# EAGLE design ultimate_Co-Op_v2_0 (EAGLE 7.4.0)
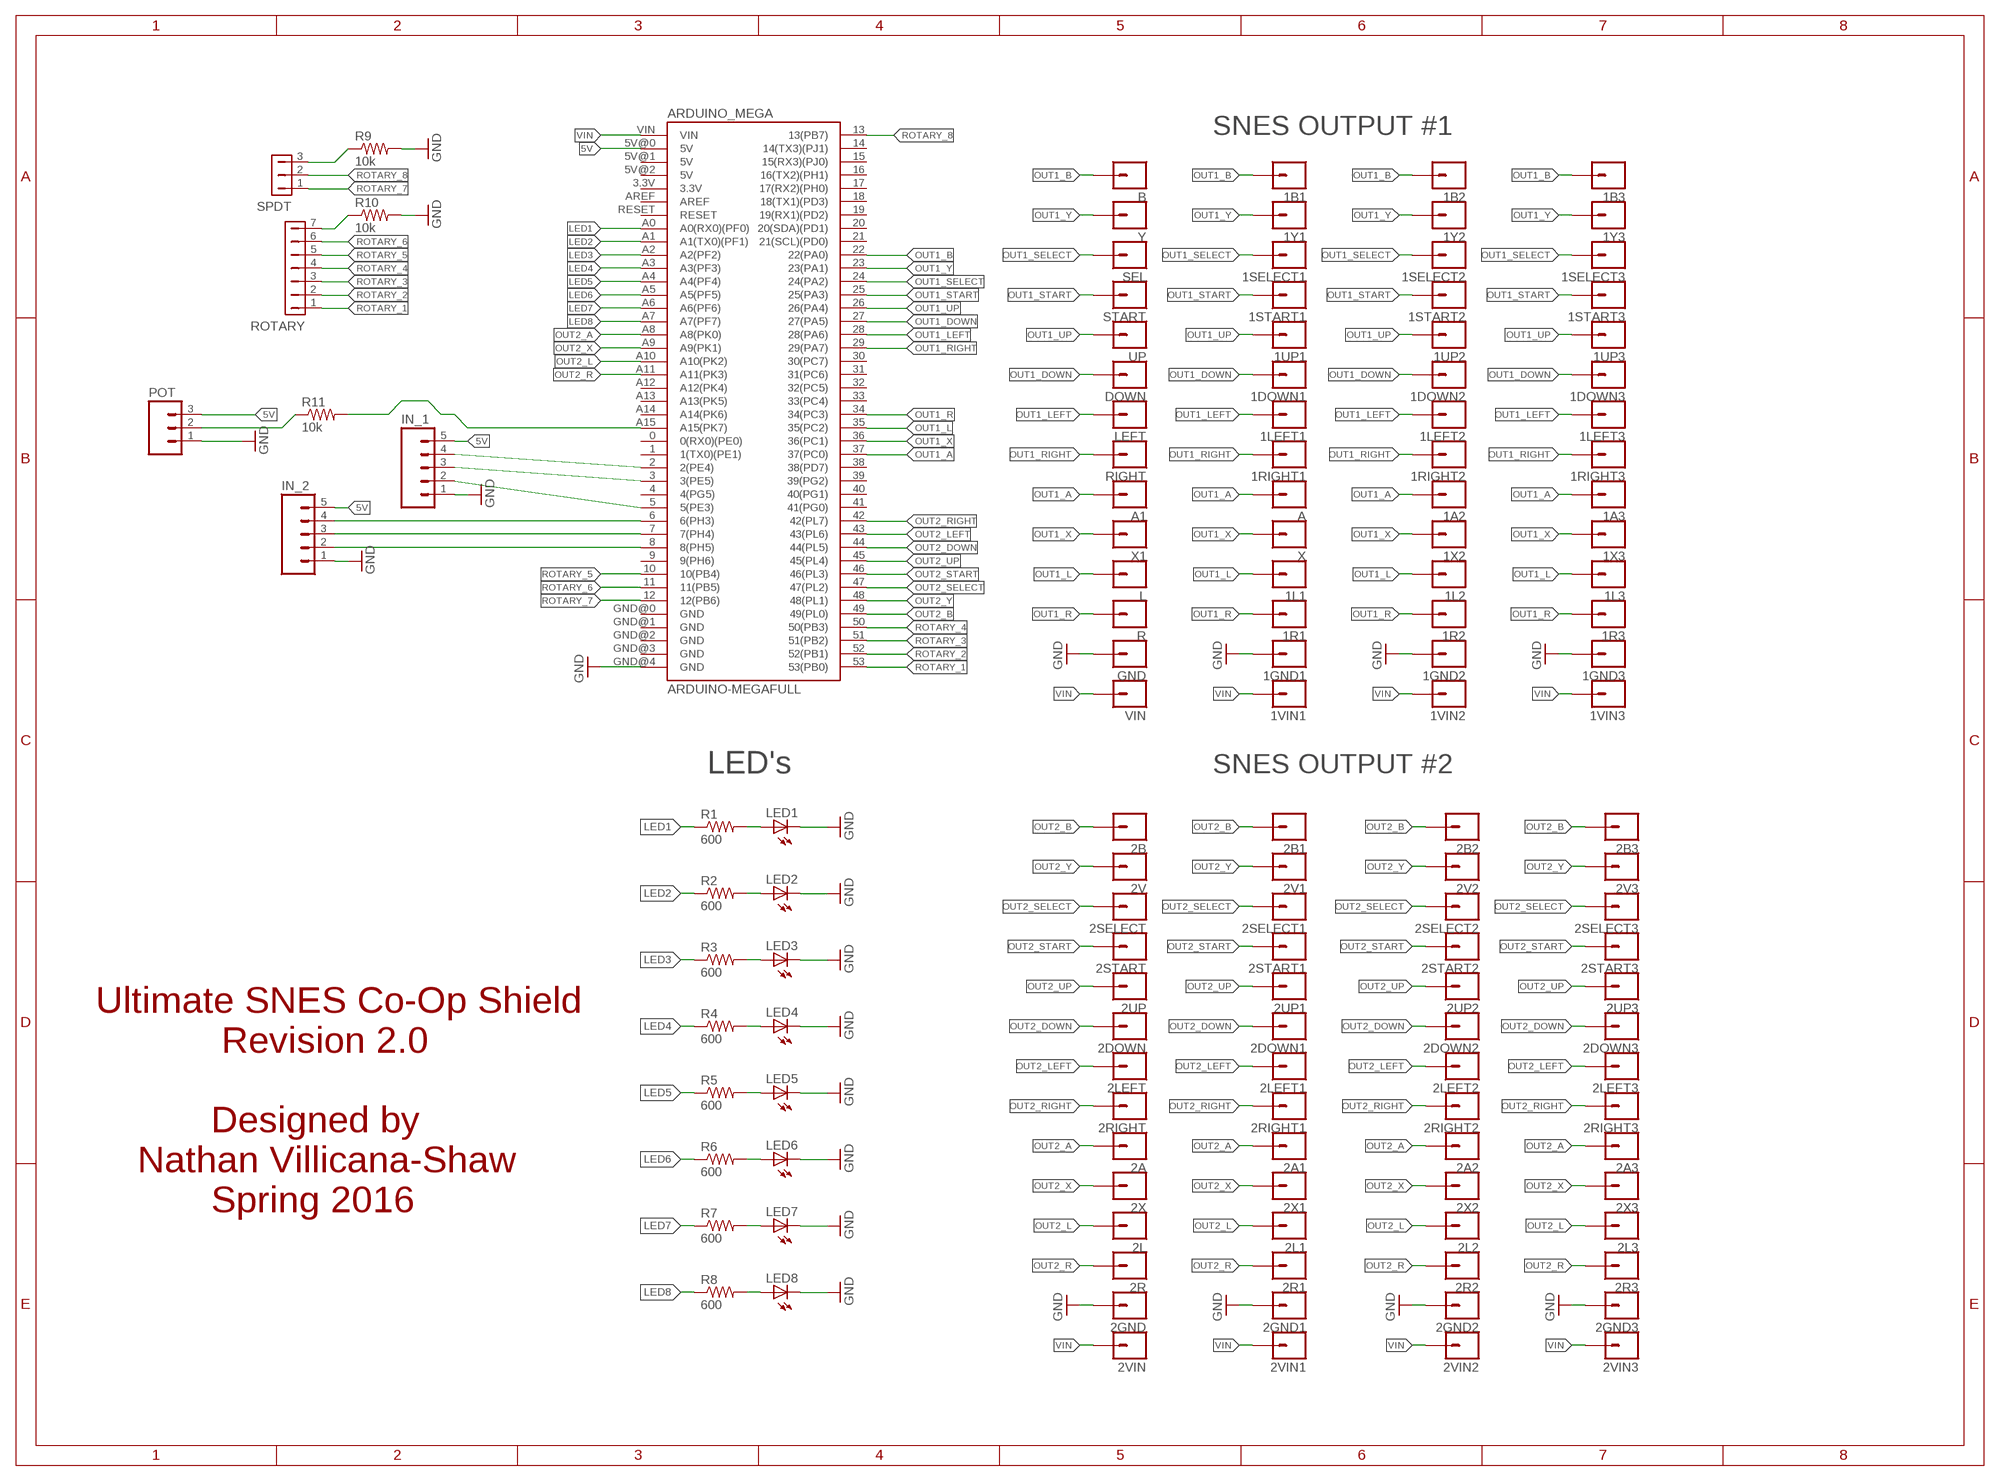
[diagram p0: schematic, sheet 1]

## Parts
1A2  M01PTH  [1X01]
1A3  M01PTH  [1X01]
1B1  M01PTH  [1X01]
1B2  M01PTH  [1X01]
1B3  M01PTH  [1X01]
1DOWN1  M01PTH  [1X01]
1DOWN2  M01PTH  [1X01]
1DOWN3  M01PTH  [1X01]
1GND1  M01PTH  [1X01]
1GND2  M01PTH  [1X01]
1GND3  M01PTH  [1X01]
1L1  M01PTH  [1X01]
1L2  M01PTH  [1X01]
1L3  M01PTH  [1X01]
1LEFT1  M01PTH  [1X01]
1LEFT2  M01PTH  [1X01]
1LEFT3  M01PTH  [1X01]
1R1  M01PTH  [1X01]
1R2  M01PTH  [1X01]
1R3  M01PTH  [1X01]
1RIGHT1  M01PTH  [1X01]
1RIGHT2  M01PTH  [1X01]
1RIGHT3  M01PTH  [1X01]
1SELECT1  M01PTH  [1X01]
1SELECT2  M01PTH  [1X01]
1SELECT3  M01PTH  [1X01]
1START1  M01PTH  [1X01]
1START2  M01PTH  [1X01]
1START3  M01PTH  [1X01]
1UP1  M01PTH  [1X01]
1UP2  M01PTH  [1X01]
1UP3  M01PTH  [1X01]
1VIN1  M01PTH  [1X01]
1VIN2  M01PTH  [1X01]
1VIN3  M01PTH  [1X01]
1X2  M01PTH  [1X01]
1X3  M01PTH  [1X01]
1Y1  M01PTH  [1X01]
1Y2  M01PTH  [1X01]
1Y3  M01PTH  [1X01]
2A  M01PTH  [1X01]
2A1  M01PTH  [1X01]
2A2  M01PTH  [1X01]
2A3  M01PTH  [1X01]
2B  M01PTH  [1X01]
2B1  M01PTH  [1X01]
2B2  M01PTH  [1X01]
2B3  M01PTH  [1X01]
2DOWN  M01PTH  [1X01]
2DOWN1  M01PTH  [1X01]
2DOWN2  M01PTH  [1X01]
2DOWN3  M01PTH  [1X01]
2GND  M01PTH  [1X01]
2GND1  M01PTH  [1X01]
2GND2  M01PTH  [1X01]
2GND3  M01PTH  [1X01]
2L  M01PTH  [1X01]
2L1  M01PTH  [1X01]
2L2  M01PTH  [1X01]
2L3  M01PTH  [1X01]
2LEFT  M01PTH  [1X01]
2LEFT1  M01PTH  [1X01]
2LEFT2  M01PTH  [1X01]
2LEFT3  M01PTH  [1X01]
2R  M01PTH  [1X01]
2R1  M01PTH  [1X01]
2R2  M01PTH  [1X01]
2R3  M01PTH  [1X01]
2RIGHT  M01PTH  [1X01]
2RIGHT1  M01PTH  [1X01]
2RIGHT2  M01PTH  [1X01]
2RIGHT3  M01PTH  [1X01]
2SELECT  M01PTH  [1X01]
2SELECT1  M01PTH  [1X01]
2SELECT2  M01PTH  [1X01]
2SELECT3  M01PTH  [1X01]
2START  M01PTH  [1X01]
2START1  M01PTH  [1X01]
2START2  M01PTH  [1X01]
2START3  M01PTH  [1X01]
2UP  M01PTH  [1X01]
2UP1  M01PTH  [1X01]
2UP2  M01PTH  [1X01]
2UP3  M01PTH  [1X01]
2V  M01PTH  [1X01]
2V1  M01PTH  [1X01]
2V2  M01PTH  [1X01]
2V3  M01PTH  [1X01]
2VIN  M01PTH  [1X01]
2VIN1  M01PTH  [1X01]
2VIN2  M01PTH  [1X01]
2VIN3  M01PTH  [1X01]
2X  M01PTH  [1X01]
2X1  M01PTH  [1X01]
2X2  M01PTH  [1X01]
2X3  M01PTH  [1X01]
A  M01PTH  [1X01]
A1  M01PTH  [1X01]
ARDUINO_MEGA  ARDUINO-MEGAFULL  [ARDUINO_MEGA]
B  M01PTH  [1X01]
DOWN  M01PTH  [1X01]
GND  M01PTH  [1X01]
IN_1  M05PTH  [1X05]
IN_2  M05PTH  [1X05]
L  M01PTH  [1X01]
LED1  LED5MM  [LED5MM]
LED2  LED5MM  [LED5MM]
LED3  LED5MM  [LED5MM]
LED4  LED5MM  [LED5MM]
LED5  LED5MM  [LED5MM]
LED6  LED5MM  [LED5MM]
LED7  LED5MM  [LED5MM]
LED8  LED5MM  [LED5MM]
LEFT  M01PTH  [1X01]
POT  M03LONGPADS  [1X03_LONGPADS]
R  M01PTH  [1X01]
R1  600  R-US_0204/7  [0204/7]
R2  600  R-US_0204/7  [0204/7]
R3  600  R-US_0204/7  [0204/7]
R4  600  R-US_0204/7  [0204/7]
R5  600  R-US_0204/7  [0204/7]
R6  600  R-US_0204/7  [0204/7]
R7  600  R-US_0204/7  [0204/7]
R8  600  R-US_0204/7  [0204/7]
R9  10k  R-US_0204/7  [0204/7]
R10  10k  R-US_0204/7  [0204/7]
R11  10k  R-US_0204/7  [0204/7]
RIGHT  M01PTH  [1X01]
ROTARY  HDR-1X7-MTE-100  [MTE-100-7V]
SEL  M01PTH  [1X01]
SPDT  HDR-1X3-MTA-100  [MTA-100-3V]
START  M01PTH  [1X01]
UP  M01PTH  [1X01]
VIN  M01PTH  [1X01]
X  M01PTH  [1X01]
X1  M01PTH  [1X01]
Y  M01PTH  [1X01]

## Nets
5V: ARDUINO_MEGA.5V@0(5V) IN_1.5 IN_2.5 POT.3
GND: 1GND1.1 1GND2.1 1GND3.1 2GND1.1 2GND2.1 2GND3.1 2GND.1 ARDUINO_MEGA.GND@4(GND) GND.1 IN_1.1 IN_2.1 LED1.K(C) LED2.K(C) LED3.K(C) LED4.K(C) LED5.K(C) LED6.K(C) LED7.K(C) LED8.K(C) POT.1 R9.2 R10.2
LED1: ARDUINO_MEGA.A0(A0(RX0)(PF0)) R1.1
LED2: ARDUINO_MEGA.A1(A1(TX0)(PF1)) R2.1
LED3: ARDUINO_MEGA.A2(A2(PF2)) R3.1
LED4: ARDUINO_MEGA.A3(A3(PF3)) R4.1
LED5: ARDUINO_MEGA.A4(A4(PF4)) R5.1
LED6: ARDUINO_MEGA.A5(A5(PF5)) R6.1
LED7: ARDUINO_MEGA.A6(A6(PF6)) R7.1
LED8: ARDUINO_MEGA.A7(A7(PF7)) R8.1
LSJDFKS: ARDUINO_MEGA.6(6(PH3)) IN_2.4
N$1: LED1.A R1.2
N$2: LED2.A R2.2
N$3: LED3.A R3.2
N$4: LED4.A R4.2
N$5: LED5.A R5.2
N$6: LED6.A R6.2
N$7: LED7.A R7.2
N$8: LED8.A R8.2
N$9: ARDUINO_MEGA.2(2(PE4)) IN_1.4
N$10: ARDUINO_MEGA.3(3(PE5)) IN_1.3
N$11: ARDUINO_MEGA.5(5(PE3)) IN_1.2
N$12: ARDUINO_MEGA.A15(A15(PK7)) R11.2
N$13: ARDUINO_MEGA.7(7(PH4)) IN_2.3
N$14: ARDUINO_MEGA.8(8(PH5)) IN_2.2
N$15: POT.2 R11.1
OIJNENLK: R9.1 SPDT.3
OIJNENLK1: R10.1 ROTARY.7
OUT1_A: 1A2.1 1A3.1 A1.1 A.1 ARDUINO_MEGA.37(37(PC0))
OUT1_B: 1B1.1 1B2.1 1B3.1 ARDUINO_MEGA.22(22(PA0)) B.1
OUT1_DOWN: 1DOWN1.1 1DOWN2.1 1DOWN3.1 ARDUINO_MEGA.27(27(PA5)) DOWN.1
OUT1_L: 1L1.1 1L2.1 1L3.1 ARDUINO_MEGA.35(35(PC2)) L.1
OUT1_LEFT: 1LEFT1.1 1LEFT2.1 1LEFT3.1 ARDUINO_MEGA.28(28(PA6)) LEFT.1
OUT1_R: 1R1.1 1R2.1 1R3.1 ARDUINO_MEGA.34(34(PC3)) R.1
OUT1_RIGHT: 1RIGHT1.1 1RIGHT2.1 1RIGHT3.1 ARDUINO_MEGA.29(29(PA7)) RIGHT.1
OUT1_SELECT: 1SELECT1.1 1SELECT2.1 1SELECT3.1 ARDUINO_MEGA.24(24(PA2)) SEL.1
OUT1_START: 1START1.1 1START2.1 1START3.1 ARDUINO_MEGA.25(25(PA3)) START.1
OUT1_UP: 1UP1.1 1UP2.1 1UP3.1 ARDUINO_MEGA.26(26(PA4)) UP.1
OUT1_X: 1X2.1 1X3.1 ARDUINO_MEGA.36(36(PC1)) X1.1 X.1
OUT1_Y: 1Y1.1 1Y2.1 1Y3.1 ARDUINO_MEGA.23(23(PA1)) Y.1
OUT2_A: 2A1.1 2A2.1 2A3.1 2A.1 ARDUINO_MEGA.A8(A8(PK0))
OUT2_B: 2B1.1 2B2.1 2B3.1 2B.1 ARDUINO_MEGA.49(49(PL0))
OUT2_DOWN: 2DOWN1.1 2DOWN2.1 2DOWN3.1 2DOWN.1 ARDUINO_MEGA.44(44(PL5))
OUT2_L: 2L1.1 2L2.1 2L3.1 2L.1 ARDUINO_MEGA.A10(A10(PK2))
OUT2_LEFT: 2LEFT1.1 2LEFT2.1 2LEFT3.1 2LEFT.1 ARDUINO_MEGA.43(43(PL6))
OUT2_R: 2R1.1 2R2.1 2R3.1 2R.1 ARDUINO_MEGA.A11(A11(PK3))
OUT2_RIGHT: 2RIGHT1.1 2RIGHT2.1 2RIGHT3.1 2RIGHT.1 ARDUINO_MEGA.42(42(PL7))
OUT2_SELECT: 2SELECT1.1 2SELECT2.1 2SELECT3.1 2SELECT.1 ARDUINO_MEGA.47(47(PL2))
OUT2_START: 2START1.1 2START2.1 2START3.1 2START.1 ARDUINO_MEGA.46(46(PL3))
OUT2_UP: 2UP1.1 2UP2.1 2UP3.1 2UP.1 ARDUINO_MEGA.45(45(PL4))
OUT2_X: 2X1.1 2X2.1 2X3.1 2X.1 ARDUINO_MEGA.A9(A9(PK1))
OUT2_Y: 2V1.1 2V2.1 2V3.1 2V.1 ARDUINO_MEGA.48(48(PL1))
ROTARY_1: ARDUINO_MEGA.53(53(PB0)) ROTARY.1
ROTARY_2: ARDUINO_MEGA.52(52(PB1)) ROTARY.2
ROTARY_3: ARDUINO_MEGA.51(51(PB2)) ROTARY.3
ROTARY_4: ARDUINO_MEGA.50(50(PB3)) ROTARY.4
ROTARY_5: ARDUINO_MEGA.10(10(PB4)) ROTARY.5
ROTARY_6: ARDUINO_MEGA.11(11(PB5)) ROTARY.6
ROTARY_7: ARDUINO_MEGA.12(12(PB6)) SPDT.1
ROTARY_8: ARDUINO_MEGA.13(13(PB7)) SPDT.2
VIN: 1VIN1.1 1VIN2.1 1VIN3.1 2VIN1.1 2VIN2.1 2VIN3.1 2VIN.1 ARDUINO_MEGA.VIN VIN.1
Unconnected: ARDUINO_MEGA.0(0(RX0)(PE0)) ARDUINO_MEGA.1(1(TX0)(PE1)) ARDUINO_MEGA.3.3V ARDUINO_MEGA.4(4(PG5)) ARDUINO_MEGA.5V@1(5V) ARDUINO_MEGA.5V@2(5V) ARDUINO_MEGA.9(9(PH6)) ARDUINO_MEGA.14(14(TX3)(PJ1)) ARDUINO_MEGA.15(15(RX3)(PJ0)) ARDUINO_MEGA.16(16(TX2)(PH1)) ARDUINO_MEGA.17(17(RX2)(PH0)) ARDUINO_MEGA.18(18(TX1)(PD3)) ARDUINO_MEGA.19(19(RX1)(PD2)) ARDUINO_MEGA.20(20(SDA)(PD1)) ARDUINO_MEGA.21(21(SCL)(PD0)) ARDUINO_MEGA.30(30(PC7)) ARDUINO_MEGA.31(31(PC6)) ARDUINO_MEGA.32(32(PC5)) ARDUINO_MEGA.33(33(PC4)) ARDUINO_MEGA.38(38(PD7)) ARDUINO_MEGA.39(39(PG2)) ARDUINO_MEGA.40(40(PG1)) ARDUINO_MEGA.41(41(PG0)) ARDUINO_MEGA.A12(A12(PK4)) ARDUINO_MEGA.A13(A13(PK5)) ARDUINO_MEGA.A14(A14(PK6)) ARDUINO_MEGA.AREF ARDUINO_MEGA.GND@0(GND) ARDUINO_MEGA.GND@1(GND) ARDUINO_MEGA.GND@2(GND) ARDUINO_MEGA.GND@3(GND) ARDUINO_MEGA.RESET

## Notes on the sheet
- SNES OUTPUT #1
- LED's | SNES OUTPUT #2
- Ultimate SNES Co-Op Shield
              Revision 2.0
  
             Designed by
      Nathan Villicana-Shaw
             Spring 2016

## Library data of the parts
1A2 1A3 1B1-1B3 1DOWN1-1DOWN3 1GND1-1GND3 1L1-1L3 1LEFT1-1LEFT3 1R1-1R3 1RIGHT1-1RIGHT3 1SELECT1-1SELECT3 1START1-1START3 1UP1-1UP3 1VIN1-1VIN3 1X2 1X3 1Y1-1Y3 2A 2A1-2A3 2B 2B1-2B3 2DOWN 2DOWN1-2DOWN3 2GND 2GND1-2GND3 2L 2L1-2L3 2LEFT 2LEFT1-2LEFT3 2R 2R1-2R3 2RIGHT 2RIGHT1-2RIGHT3 2SELECT 2SELECT1-2SELECT3 2START 2START1-2START3 2UP 2UP1-2UP3 2V 2V1-2V3 2VIN 2VIN1-2VIN3 2X 2X1-2X3 A A1 B DOWN GND L LEFT R RIGHT SEL START UP VIN X X1 Y = SparkFun-Connectors:M01: Header 1 Standard 1-pin 0.1" header. Use with straight break away headers (SKU : PRT-00116), right angle break away headers (PRT-00553), swiss pins (PRT-00743), machine pins (PRT-00117), and female headers (PRT-00115). SMTSO-256-ET is a "flush mount" nut for a 4-40 screw. The older package used to be too tight, and did not allow it to sit properly thru the drill hit. The latest (0.165DIA) fits nice and snug.
ARDUINO_MEGA = Nathans-Boards_small_mega:ARDUINO-MEGA: Arduino Mega board footprint
IN_1 IN_2 = SparkFun-Connectors:M05: Header 5 Standard 5-pin 0.1" header. Use with straight break away headers (SKU : PRT-00116), right angle break away headers (PRT-00553), swiss pins (PRT-00743), machine pins (PRT-00117), and female headers (PRT-00115). Molex polarized connector foot print use with SKU : PRT-08230 with associated crimp pins and housings.
LED1-LED8 = adafruit:LED: LED OSRAM: - CHIPLED LG R971, LG N971, LY N971, LG Q971, LY Q971, LO R971, LY R971 LH N974, LH R974 LS Q976, LO Q976, LY Q976 LO Q996 - Hyper CHIPLED LW Q18S LB Q993, LB Q99A, LB R99A - SideLED LS A670, LO A670, LY A670, LG A670, LP A670 LB A673, LV A673, LT A673, LW A673 LH A674 LY A675 LS A676, LA A676, LO A676, LY A676, LW A676 LS A679, LY A679, LG A679 - Hyper Micro SIDELED® LS Y876, LA Y876, LO Y876, LY Y876 LT Y87S - SmartLED LW L88C, LW L88S LB L89C, LB L89S, LG L890 LS L89K, LO L89K, LY L89K LS L896, LA L896, LO L896, LY L896 - TOPLED LS T670, LO T670, LY T670, LG T670, LP T670 LSG T670, LSP T670, LSY T670, LOP T670, LYG T670 LG T671, LOG T671, LSG T671 LB T673, LV T673, LT T673, LW T673 LH T674 LS T676, LA T676, LO T676, LY T676, LB T676, LH T676, LSB T676, LW T676 LB T67C, LV T67C, LT T67C, LS T67K, LO T67K, LY T67K, LW E67C LS E67B, LA E67B, LO E67B, LY E67B, LB E67C, LV E67C, LT E67C LW T67C LS T679, LY T679, LG T679 LS T770, LO T770, LY T770, LG T770, LP T770 LB T773, LV T773, LT T773, LW T773 LH T774 LS E675, LA E675, LY E675, LS T675 LS T776, LA T776, LO T776, LY T776, LB T776 LHGB T686 LT T68C, LB T68C - Hyper Mini TOPLED® LB M676 - Mini TOPLED Santana® LG M470 LS M47K, LO M47K, LY M47K Source: http://www.osram.convergy.de/
POT = SparkFun-Connectors:M03: Header 3 Standard 3-pin 0.1" header. Use with straight break away headers (SKU : PRT-00116), right angle break away headers (PRT-00553), swiss pins (PRT-00743), machine pins (PRT-00117), and female headers (PRT-00115). Molex polarized connector foot print use with SKU : PRT-08232 with associated crimp pins and housings.
R1-R11 = adafruit:R-US_: RESISTOR, American symbol
ROTARY = con-hdrs40:HDR-1X7: HEADER CONNECTOR
SPDT = con-hdrs40:HDR-1X3: HEADER CONNECTOR

## Net classes
0 default: width 0.229 mm, drill 0.254 mm, clearance 0.203 mm

## Board
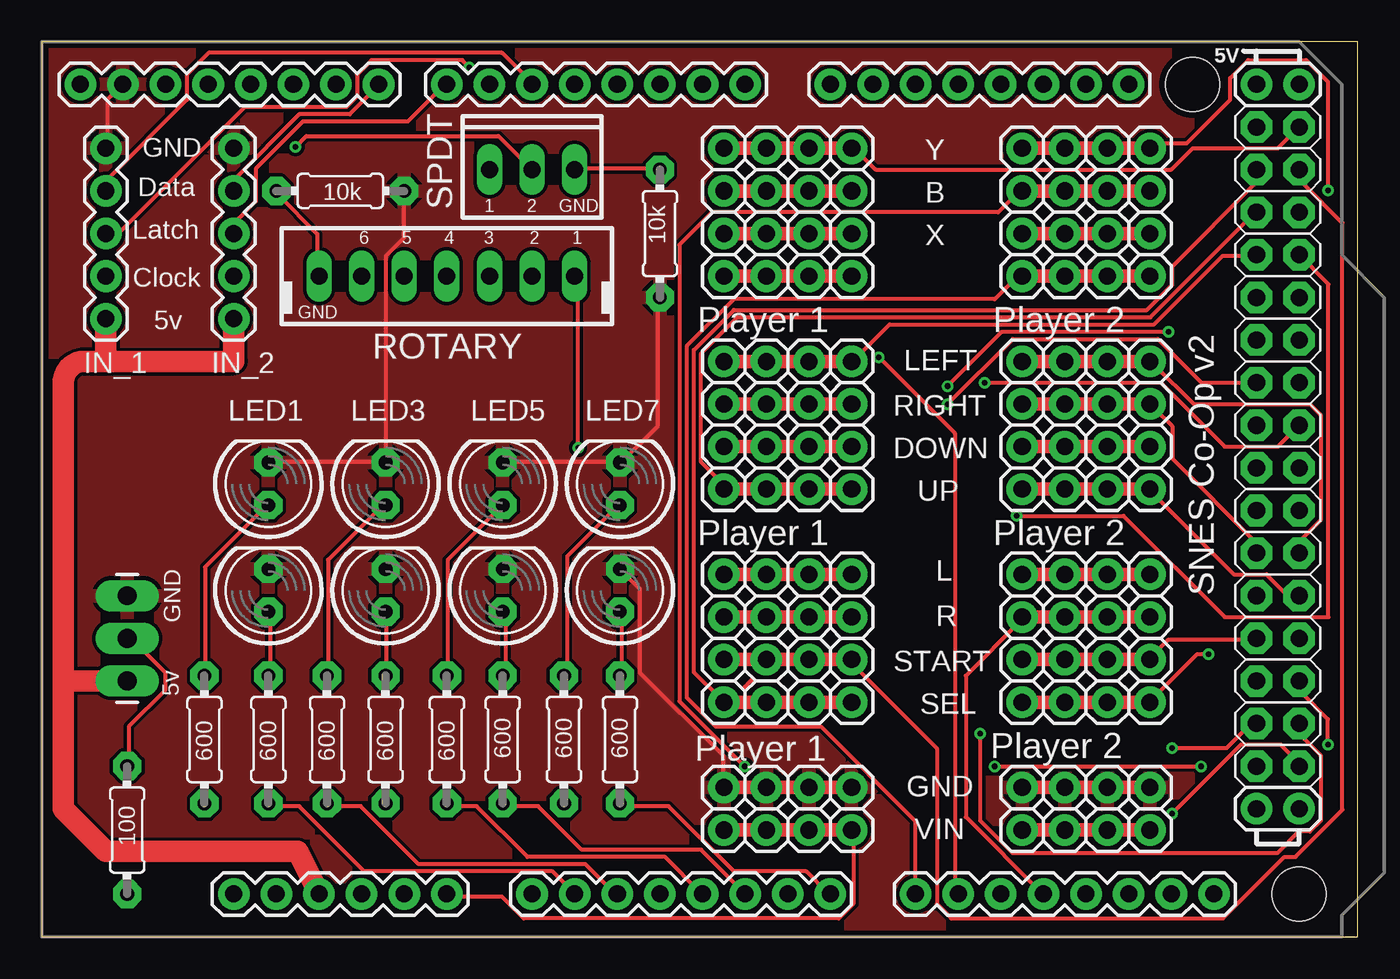
[diagram p1: board, top side]
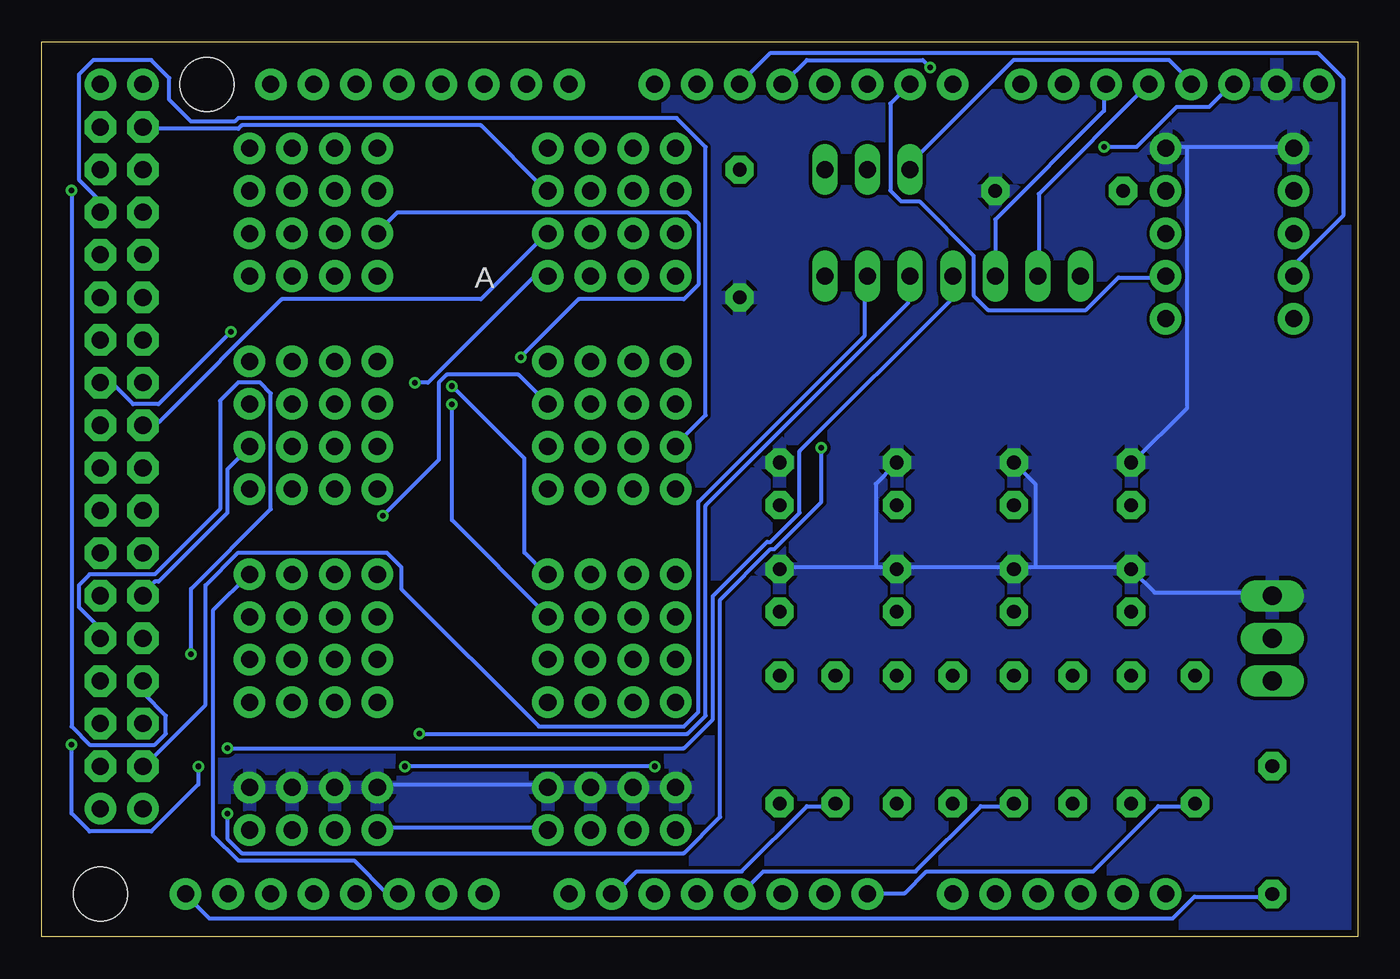
[diagram p2: board, bottom side, seen from below]

Size 78.41 x 53.33 mm. Coordinates in mm from the lower left corner, seen from the top.
Outline: 0,0 78.41,0 78.41,53.33 0,53.33 0,0
Copper layers (1*16): Top 0.0356mm / dielectric 1.5011mm / Bottom 0.0356mm
Design rules "LaenPCBOrder": minimum track width 6mil, minimum drill 13mil, track to track 6mil, track to pad 6mil, pad to pad 6mil, via to via 6mil, smd to smd 6mil, copper to edge 15mil, drill to drill 6mil, minimum pad ring 7mil, minimum via ring 7mil, stop-mask expansion 3mil, vias tented up to drill 0mil, thermal gap 10mil

### Footprints (pad centres in the part's own frame; a part is rotated, then mirrored left to right if it is on the bottom)
1X01 = drill 1.016 pad 1.88: 1 0,0
ARDUINO_MEGA = drill 1.016 pad 1.88: 0 41.91,50.8; 1 39.37,50.8; 2 36.83,50.8; 3 34.29,50.8; 3.3V 13.97,2.54; 4 31.75,50.8; 5 29.21,50.8; 5V@0 16.51,2.54; 5V@1 72.39,50.8; 5V@2 74.93,50.8; 6 26.67,50.8; 7 24.13,50.8; 8 20.066,50.8; 9 17.526,50.8; 10 14.986,50.8; 11 12.446,50.8; 12 9.906,50.8; 13 7.366,50.8; 14 46.99,50.8; 15 49.53,50.8; 16 52.07,50.8; 17 54.61,50.8; 18 57.15,50.8; 19 59.69,50.8; 20 62.23,50.8; 21 64.77,50.8; A0 29.21,2.54; A1 31.75,2.54; A2 34.29,2.54; A3 36.83,2.54; A4 39.37,2.54; A5 41.91,2.54; A6 44.45,2.54; A7 46.99,2.54; A8 52.07,2.54; A9 54.61,2.54; A10 57.15,2.54; A11 59.69,2.54; A12 62.23,2.54; A13 64.77,2.54; A14 67.31,2.54; A15 69.85,2.54; AREF 2.286,50.8; GND@0 19.05,2.54; GND@1 21.59,2.54; GND@2 72.39,7.62; GND@3 74.93,7.62; GND@4 4.826,50.8; RESET 11.43,2.54; VIN 24.13,2.54 | drill 1.016 pad 1.88 octagon: 22 72.39,48.26; 23 74.93,48.26; 24 72.39,45.72; 25 74.93,45.72; 26 72.39,43.18; 27 74.93,43.18; 28 72.39,40.64; 29 74.93,40.64; 30 72.39,38.1; 31 74.93,38.1; 32 72.39,35.56; 33 74.93,35.56; 34 72.39,33.02; 35 74.93,33.02; 36 72.39,30.48; 37 74.93,30.48; 38 72.39,27.94; 39 74.93,27.94; 40 72.39,25.4; 41 74.93,25.4; 42 72.39,22.86; 43 74.93,22.86; 44 72.39,20.32; 45 74.93,20.32; 46 72.39,17.78; 47 74.93,17.78; 48 72.39,15.24; 49 74.93,15.24; 50 72.39,12.7; 51 74.93,12.7; 52 72.39,10.16; 53 74.93,10.16 | hole 3.2: 68.58,50.8; 74.93,2.54
1X05 = drill 1.016 pad 1.88: 1 0,0; 2 2.54,0; 3 5.08,0; 4 7.62,0; 5 10.16,0
LED5MM = drill 0.813 pad 1.676 octagon: A -1.27,0; K 1.27,0
1X03_LONGPADS = drill 1.118 pad 1.88 long: 1 0,0; 2 2.54,0; 3 5.08,0
0204/7 = drill 0.813 pad 1.676 octagon: 1 -3.81,0; 2 3.81,0
MTE-100-7V = drill 1.016 long: 1 -7.62,0; 2 -5.08,0; 3 -2.54,0; 4 0,0; 5 2.54,0; 6 5.08,0; 7 7.62,0
MTA-100-3V = drill 1.016 long: 1 -2.54,0; 2 0,0; 3 2.54,0

### Placement (x,y rotation side)
1A2  40.64,39.37 90 top
1A3  43.18,39.37 90 top
1B1  45.72,44.45 90 top
1B2  43.18,44.45 90 top
1B3  40.64,44.45 90 top
1DOWN1  45.72,29.21 90 top
1DOWN2  43.18,29.21 180 top
1DOWN3  40.64,29.21 180 top
1GND1  45.72,8.89 90 top
1GND2  40.64,8.89 90 top
1GND3  43.18,8.89 180 top
1L1  48.26,21.59 0 top
1L2  40.64,21.59 90 top
1L3  43.18,21.59 90 top
1LEFT1  45.72,34.29 90 top
1LEFT2  43.18,34.29 180 top
1LEFT3  40.64,34.29 90 top
1R1  43.18,19.05 90 top
1R2  40.64,19.05 90 top
1R3  45.72,19.05 180 top
1RIGHT1  45.72,31.75 90 top
1RIGHT2  40.64,31.75 90 top
1RIGHT3  43.18,31.75 90 top
1SELECT1  45.72,13.97 90 top
1SELECT2  43.18,13.97 180 top
1SELECT3  40.64,13.97 90 top
1START1  45.72,16.51 90 top
1START2  43.18,16.51 180 top
1START3  40.64,16.51 180 top
1UP1  45.72,26.67 90 top
1UP2  43.18,26.67 180 top
1UP3  40.64,26.67 90 top
1VIN1  45.72,6.35 90 top
1VIN2  43.18,6.35 90 top
1VIN3  40.64,6.35 90 top
1X2  43.18,41.91 90 top
1X3  40.64,41.91 90 top
1Y1  45.72,46.99 90 top
1Y2  40.64,46.99 90 top
1Y3  43.18,46.99 90 top
2A  66.04,39.37 90 top
2A1  63.5,39.37 180 top
2A2  58.42,39.37 90 top
2A3  60.96,39.37 180 top
2B  66.04,44.45 180 top
2B1  60.96,44.45 0 top
2B2  63.5,44.45 0 top
2B3  58.42,44.45 0 top
2DOWN  66.04,29.21 180 top
2DOWN1  63.5,29.21 0 top
2DOWN2  60.96,29.21 0 top
2DOWN3  58.42,29.21 0 top
2GND  66.04,8.89 90 top
2GND1  60.96,8.89 0 top
2GND2  58.42,8.89 0 top
2GND3  63.5,8.89 0 top
2L  58.42,21.59 270 top
2L1  60.96,21.59 270 top
2L2  66.04,21.59 0 top
2L3  63.5,21.59 270 top
2LEFT  58.42,34.29 0 top
2LEFT1  60.96,34.29 270 top
2LEFT2  63.5,34.29 180 top
2LEFT3  66.04,34.29 180 top
2R  58.42,19.05 270 top
2R1  66.04,19.05 270 top
2R2  63.5,19.05 270 top
2R3  60.96,19.05 0 top
2RIGHT  58.42,31.75 0 top
2RIGHT1  66.04,31.75 180 top
2RIGHT2  60.96,31.75 180 top
2RIGHT3  63.5,31.75 180 top
2SELECT  66.04,13.97 180 top
2SELECT1  63.5,13.97 0 top
2SELECT2  60.96,13.97 0 top
2SELECT3  58.42,13.97 0 top
2START  66.04,16.51 180 top
2START1  58.42,16.51 0 top
2START2  63.5,16.51 0 top
2START3  60.96,16.51 0 top
2UP  66.04,26.67 180 top
2UP1  58.42,26.67 0 top
2UP2  63.5,26.67 0 top
2UP3  60.96,26.67 0 top
2V  66.04,46.99 180 top
2V1  58.42,46.99 0 top
2V2  63.5,46.99 0 top
2V3  60.96,46.99 0 top
2VIN  66.04,6.35 0 top
2VIN1  58.42,6.35 0 top
2VIN2  63.5,6.35 0 top
2VIN3  60.96,6.35 0 top
2X  66.04,41.91 90 top
2X1  58.42,41.91 180 top
2X2  63.5,41.91 180 top
2X3  60.96,41.91 90 top
A  48.26,39.37 270 top
A1  45.72,39.37 270 top
ARDUINO_MEGA  0,0 0 top
B  48.26,44.45 0 top
DOWN  48.26,29.21 0 top
GND  48.26,8.89 0 top
IN_1  3.81,46.99 270 top
IN_2  11.43,46.99 270 top
L  45.72,21.59 0 top
LED1  13.49,26.99 90 top
LED2  13.49,20.64 90 top
LED3  20.48,26.99 90 top
LED4  20.48,20.64 90 top
LED5  27.46,26.99 90 top
LED6  27.46,20.64 90 top
LED7  34.45,26.99 90 top
LED8  34.45,20.64 90 top
LEFT  48.26,34.29 0 top
POT  5.08,20.32 270 top
R  48.26,19.05 0 top
R1  9.68,11.75 90 top
R2  13.49,11.75 90 top
R3  16.99,11.75 90 top
R4  20.48,11.75 90 top
R5  24.13,11.75 90 top
R6  27.46,11.75 90 top
R7  31.11,11.75 90 top
R8  34.45,11.75 90 top
R9  36.83,41.91 270 top
R10  17.78,44.45 0 top
R11  5.08,6.35 270 top
RIGHT  48.26,31.75 0 top
ROTARY  24.13,39.37 180 top
SEL  48.26,13.97 0 top
SPDT  29.21,45.72 0 top
START  48.26,16.51 0 top
UP  48.26,26.67 0 top
VIN  48.26,6.35 0 top
X  48.26,41.91 0 top
X1  45.72,41.91 270 top
Y  48.26,46.99 0 top

### Tracks (layer width: path | path; a pad name or v marks a point on that pad's centre or on a via)
5V
  Top 1.27: 1.27,15.24 1.27,33.02 arc-90 2.54,34.29 3.81,34.29 | 1.27,15.24 1.27,7.62 3.81,5.08 15.24,5.08 ARDUINO_MEGA.5V@0 | 3.81,34.29 11.43,34.29 IN_2.5 | IN_1.5 3.81,34.29 | POT.3 1.27,15.24
GND
  Top 0.229: IN_1.1 3.89,47.07 3.89,49.87 4.75,50.74 ARDUINO_MEGA.GND@4 | LED1.K 13.6,28.28 20.3,28.28 LED3.K 20.51,28.28 20.51,40.59 21.59,41.67 R10.2 | 43.18,9.07 1GND3.1 | 45.55,8.89 45.55,8.85 1GND1.1 | 2GND1.1 61.1,9.07 61.1,8.89 | 63.48,8.89 63.48,8.85 2GND3.1 | LED5.K 27.64,28.28 34.33,28.28 LED7.K 34.54,28.28 36.7,30.44 36.7,38 R9.2 | 1GND2.1 40.59,9.28 40.59,10.79 35.62,15.76 35.62,20.73 34.54,21.81 LED8.K
  Top 0.813: 1GND2.1 1GND3.1 45.55,8.89 1GND1.1 GND.1 | 2GND2.1 2GND1.1 61.1,8.89 63.48,8.89 2GND3.1 2GND.1
  Bottom 0.229: 19.21,22.02 20.3,22.02 LED4.K 20.51,22.02 27.42,22.02 LED6.K 27.64,22.02 28.71,22.02 | 19.21,22.02 13.6,22.02 LED2.K 13.39,21.81 12.09,20.51 5.18,20.51 POT.1 | 10.15,47.07 3.89,47.07 IN_1.1 | 10.15,47.07 11.23,47.07 IN_2.1 | 10.15,47.07 10.15,31.52 13.39,28.28 LED1.K | 19.21,22.02 19.21,26.99 20.3,28.07 LED3.K | GND.1 48.36,9.07 58.29,9.07 2GND2.1 | 28.71,22.02 34.33,22.02 LED8.K | 28.71,22.02 28.71,26.99 27.64,28.07 LED5.K
  pour Top: 0,0 77.47,0 77.47,1.27 80.01,3.81 80.01,38.1 77.47,40.64 77.47,50.8 74.93,53.34 0,53.34
  pour Bottom: 0,53.34 0,0 77.47,0 77.47,1.27 80.01,3.81 80.01,38.1 77.47,40.64 77.47,50.8 74.93,53.34
GND1
  Top 0.229: 42.32,15.33 42.26,15.24 42.23,15.24 42.07,15.08 42.01,14.99 41.88,14.9
LED1
  Bottom 0.229: R1.1 9.72,7.77 11.87,7.77 15.76,3.89 25.69,3.89 26.99,2.59 29.15,2.59 ARDUINO_MEGA.A0
LED2
  Top 0.229: R2.1 13.6,7.77 15.33,7.77 19.21,3.89 30.44,3.89 31.74,2.59 ARDUINO_MEGA.A1
LED3
  Top 0.229: R3.1 17.06,7.77 19,7.77 22.45,4.32 32.38,4.32 34.11,2.59 ARDUINO_MEGA.A2
LED4
  Bottom 0.229: R4.1 20.51,7.77 22.45,7.77 26.34,3.89 35.41,3.89 36.7,2.59 ARDUINO_MEGA.A3
LED5
  Top 0.229: R5.1 24.18,7.77 25.91,7.77 28.93,4.75 37.13,4.75 39.29,2.59 ARDUINO_MEGA.A4
LED6
  Top 0.229: R6.1 27.64,7.77 29.58,7.77 32.17,5.18 39.29,5.18 41.88,2.59 ARDUINO_MEGA.A5
LED7
  Bottom 0.229: R7.1 31.3,7.77 32.82,7.77 36.7,3.89 42.96,3.89 44.26,2.59 ARDUINO_MEGA.A6
LED8
  Top 0.229: R8.1 34.54,7.77 37.35,7.77 41.24,3.89 45.55,3.89 46.85,2.59 ARDUINO_MEGA.A7
LSJDFKS
  Bottom 0.229: IN_2.4 11.44,39.29 14.25,39.29 16.19,37.35 22.02,37.35 22.89,38.21 22.89,40.59 26.12,43.83 27.2,43.83 27.85,44.48 27.85,49.66 26.77,50.74 ARDUINO_MEGA.6
N$1
  Top 0.229: R1.2 9.72,15.76 9.72,22.02 13.39,25.69 LED1.A
N$2
  Top 0.229: R2.2 13.6,15.76 13.6,19.21 LED2.A
N$3
  Top 0.229: R3.2 17.06,15.76 17.06,22.45 20.3,25.69 LED3.A
N$4
  Top 0.229: R4.2 20.51,15.76 20.51,19.21 LED4.A
N$5
  Top 0.229: R5.2 24.18,15.76 24.18,22.45 27.42,25.69 LED5.A
N$6
  Top 0.229: R6.2 27.64,15.76 27.64,19.21 LED6.A
N$7
  Top 0.229: R7.2 31.3,15.76 31.3,22.67 34.33,25.69 LED7.A
N$8
  Top 0.229: R8.2 34.54,15.76 34.54,19.21 LED8.A
N$9
  Bottom 0.229: IN_1.4 3.67,39.51 3.67,40.16 0.86,42.96 0.86,51.17 2.38,52.68 34.98,52.68 36.7,50.95 ARDUINO_MEGA.2
N$10  (via drill 0.33)
  Top 0.229: v25.48,51.82 25.04,52.25 19.65,52.25 18.78,51.38 18.78,50.09 18.14,49.44 12.09,49.44 4.75,42.1 3.89,42.1 IN_1.3
  Bottom 0.229: v25.48,51.82 25.91,52.25 32.82,52.25 34.11,50.95 ARDUINO_MEGA.3
N$11
  Top 0.229: IN_1.2 3.89,44.48 3.89,45.12 8.64,49.87 8.64,51.38 9.93,52.68 27.42,52.68 29.15,50.95 ARDUINO_MEGA.5
N$12
  Bottom 0.229: R11.2 5.18,2.38 9.72,2.38 11.01,1.08 68.44,1.08 69.74,2.38 ARDUINO_MEGA.A15
N$13
  Top 0.229: IN_2.3 11.44,42.1 11.44,42.53 12.74,43.83 12.74,45.77 15.54,48.58 21.81,48.58 23.96,50.74 ARDUINO_MEGA.7
N$14
  Top 0.229: IN_2.2 11.44,44.48 11.44,45.12 15.33,49.01 18.35,49.01 20.08,50.74 ARDUINO_MEGA.8
N$15
  Top 0.229: R11.1 5.18,10.36 5.18,12.52 7.34,14.68 7.34,15.76 5.18,17.92 POT.2
OIJNENLK
  Top 0.229: SPDT.3 31.95,45.77 36.7,45.77 R9.1
OIJNENLK1
  Top 0.229: ROTARY.7 16.41,39.51 16.41,41.88 14.03,44.26 R10.1
OUT1_A  (via drill 0.33)
  Top 0.229: 43.18,39.51 1A3.1 | 45.55,39.37 45.55,39.29 A1.1 | ARDUINO_MEGA.37 73.66,29.21 70.48,29.21 66.67,33.02 v56.2,33.02
  Top 0.813: 1A2.1 1A3.1 45.55,39.37 A1.1 A.1
  Bottom 0.229: v56.2,33.02 55.4,33.02 49.05,39.37 A.1
OUT1_B
  Top 0.229: 43.18,44.48 1B2.1 | 45.55,44.45 45.55,44.48 1B1.1
  Top 0.813: 1B3.1 1B2.1 45.55,44.45 1B1.1 B.1
  Bottom 0.229: ARDUINO_MEGA.22 72.33,48.15 66.71,48.15 66.5,48.36 52.25,48.36 48.36,44.48 B.1
OUT1_DOWN
  Top 0.229: 43.18,29.36 1DOWN2.1 | 45.55,29.21 45.55,29.15 1DOWN1.1
  Top 0.813: 1DOWN3.1 1DOWN2.1 45.55,29.21 1DOWN1.1 DOWN.1
  Bottom 0.229: ARDUINO_MEGA.27 75.13,43.18 75.13,44.04 76.21,45.12 76.21,51.38 75.35,52.25 71.89,52.25 70.81,51.17 70.81,49.87 69.52,48.58 66.93,48.58 66.71,48.79 40.59,48.79 38.86,47.07 38.86,31.09 40.59,29.36 1DOWN3.1
OUT1_L  (via drill 0.33)
  Top 0.229: v67.14,36.05 57.21,36.05 v53.98,32.82
  Top 0.813: 1L2.1 1L3.1 L.1 1L1.1
  Bottom 0.229: v67.14,36.05 71.46,31.74 72.97,31.74 74.05,32.82 74.92,32.82 ARDUINO_MEGA.35 | v53.98,32.82 49.66,28.5 49.66,22.89 48.36,21.59 1L1.1
OUT1_LEFT
  Top 0.229: 43.18,34.33 1LEFT2.1 | 45.55,34.29 45.55,34.33 1LEFT1.1 | ARDUINO_MEGA.28 72.33,40.59 70.38,40.59 66.28,36.49 50.52,36.49 48.58,34.54 LEFT.1
  Top 0.813: 1LEFT3.1 1LEFT2.1 45.55,34.29 1LEFT1.1 LEFT.1
OUT1_R  (via drill 0.33)
  Top 0.229: 43.18,19.21 1R1.1 | 45.55,19.05 45.55,19 1R3.1 | v53.98,31.74 57.86,35.62 66.5,35.62 69.09,33.03 72.33,33.03 ARDUINO_MEGA.34
  Top 0.813: 1R2.1 1R1.1 45.55,19.05 1R3.1 R.1
  Bottom 0.229: v53.98,31.74 53.98,24.83 48.36,19.21 R.1
OUT1_RIGHT  (via drill 0.33)
  Top 0.229: 43.18,31.74 1RIGHT3.1 | 45.55,31.75 45.55,31.74 1RIGHT1.1 | ARDUINO_MEGA.29 76.68,38.89 76.68,19.05 70.48,19.05 64.45,25.08 v58.1,25.08
  Top 0.813: 1RIGHT2.1 1RIGHT3.1 45.55,31.75 1RIGHT1.1 RIGHT.1
  Bottom 0.229: v58.1,25.08 54.77,28.42 54.77,33.02 54.29,33.5 50.01,33.5 RIGHT.1
OUT1_SELECT
  Top 0.229: 43.18,14.03 1SELECT2.1 | 45.55,13.97 45.55,14.03 1SELECT1.1 | ARDUINO_MEGA.24 72.33,45.55 72.33,44.91 67.36,39.94 67.36,38.86 65.85,37.35 41.24,37.35 38.86,34.98 38.86,15.76 40.37,14.25 1SELECT3.1
  Top 0.813: 1SELECT3.1 1SELECT2.1 45.55,13.97 1SELECT1.1 SEL.1
OUT1_START
  Top 0.229: 43.18,16.62 1START2.1 | 45.55,16.51 45.55,16.62 1START1.1 | ARDUINO_MEGA.25 75.13,45.55 75.13,44.91 77.51,42.53 77.51,7.56 74.7,4.75 74.05,4.75 70.38,1.08 54.19,1.08 53.33,1.94 53.33,11.23 48.36,16.19 START.1
  Top 0.813: 1START3.1 1START2.1 45.55,16.51 1START1.1 START.1
OUT1_UP
  Top 0.229: 43.18,26.77 1UP2.1 | 45.55,26.67 45.55,26.77 1UP1.1 | ARDUINO_MEGA.26 72.33,43.18 66.06,36.92 41.45,36.92 39.29,34.76 39.29,28.28 40.59,26.99 1UP3.1
  Top 0.813: 1UP3.1 1UP2.1 45.55,26.67 1UP1.1 UP.1
OUT1_X
  Top 0.229: 43.18,41.88 1X2.1 | 45.55,41.91 45.55,41.88 X1.1
  Top 0.813: 1X3.1 1X2.1 45.55,41.91 X1.1 X.1
  Bottom 0.229: ARDUINO_MEGA.36 72.33,30.66 71.46,30.66 64.12,38 52.25,38 48.36,41.88 X.1
OUT1_Y
  Top 0.229: 43.18,47.07 1Y3.1 | 45.55,46.99 45.55,47.07 1Y1.1 | ARDUINO_MEGA.23 73.66,46.99 68.58,46.99 67.31,45.72 49.69,45.72 48.58,46.83 Y.1
  Top 0.813: 1Y2.1 1Y3.1 45.55,46.99 1Y1.1 Y.1
OUT2_A
  Top 0.229: ARDUINO_MEGA.A8 52.03,2.59 52.03,6.91 46.42,12.52 40.16,12.52 38.43,14.25 38.43,35.19 41.24,38 56.78,38 58.08,39.29 2A2.1 | 2A3.1 61.1,39.51 61.1,39.37 | 2A1.1 63.48,39.51 63.48,39.37
  Top 0.813: 2A2.1 2A3.1 61.1,39.37 63.48,39.37 2A1.1 2A.1
OUT2_B  (via drill 0.33)
  Top 0.229: 2B1.1 61.1,44.48 61.1,44.45 | 63.48,44.45 63.48,44.48 2B2.1 | v76.64,11.44 76.64,12.95 75.13,14.46 75.13,15.11 ARDUINO_MEGA.49 | v56.78,10.15 v69.09,10.15 | v41.88,10.15 38,14.03 38,41.24 39.94,43.18 57,43.18 58.08,44.26 2B3.1
  Top 0.813: 2B3.1 2B1.1 61.1,44.45 63.48,44.45 2B2.1 2B.1
  Bottom 0.229: v76.64,11.44 76.64,7.34 75.56,6.26 71.89,6.26 69.09,9.07 v69.09,10.15 | v41.88,10.15 v56.78,10.15
OUT2_DOWN
  Top 0.229: 2DOWN2.1 61.1,29.36 61.1,29.21 | 63.48,29.21 63.48,29.15 2DOWN1.1
  Top 0.813: 2DOWN3.1 2DOWN2.1 61.1,29.21 63.48,29.21 2DOWN1.1 2DOWN.1
  Bottom 0.229: ARDUINO_MEGA.44 72.33,20.51 71.68,21.16 71.46,21.16 67.36,25.26 67.36,27.85 66.06,29.15 2DOWN.1
OUT2_L
  Top 0.813: 2L.1 2L1.1 2L3.1 2L2.1
  Bottom 0.229: ARDUINO_MEGA.A10 57.21,2.59 57.86,2.59 59.8,4.53 66.71,4.53 68.22,6.04 68.22,19.43 66.06,21.59 2L2.1
OUT2_LEFT
  Top 0.229: 2LEFT1.1 61.1,34.33 61.1,34.29 | 63.48,34.29 63.48,34.33 2LEFT2.1 | ARDUINO_MEGA.43 75.13,22.89 75.13,23.75 76.21,24.83 76.21,31.09 75.56,31.74 68.66,31.74 66.28,34.11 2LEFT3.1
  Top 0.813: 2LEFT.1 2LEFT1.1 61.1,34.29 63.48,34.29 2LEFT2.1 2LEFT3.1
OUT2_R
  Top 0.229: ARDUINO_MEGA.A11 59.59,2.59 55.05,7.12 55.05,15.54 58.29,18.78 2R.1 | 2R3.1 61.1,19.21 61.1,19.05 | 2R2.1 63.48,19.21 63.48,19.05
  Top 0.813: 2R.1 2R3.1 61.1,19.05 63.48,19.05 2R2.1 2R1.1
OUT2_RIGHT
  Top 0.229: 2RIGHT2.1 61.1,31.74 61.1,31.75 | 63.48,31.75 63.48,31.74 2RIGHT3.1 | ARDUINO_MEGA.42 72.33,22.89 72.33,23.53 67.36,28.5 67.36,30.44 66.28,31.52 2RIGHT1.1
  Top 0.813: 2RIGHT.1 2RIGHT2.1 61.1,31.75 63.48,31.75 2RIGHT3.1 2RIGHT1.1
OUT2_SELECT  (via drill 0.33)
  Top 0.229: 2SELECT2.1 61.1,14.03 61.1,13.97 | 63.48,13.97 63.48,14.03 2SELECT1.1 | v69.52,16.84 68.87,16.84 66.28,14.25 2SELECT.1
  Top 0.813: 2SELECT3.1 2SELECT2.1 61.1,13.97 63.48,13.97 2SELECT1.1 2SELECT.1
  Bottom 0.229: v69.52,16.84 69.52,20.73 64.77,25.48 64.77,32.38 65.42,33.03 66.71,33.03 67.79,31.95 67.79,25.48 71.68,21.59 75.56,21.59 76.21,20.94 76.21,19.65 75.13,18.57 75.13,17.92 ARDUINO_MEGA.47
OUT2_START
  Top 0.229: 2START3.1 61.1,16.62 61.1,16.51 | 63.48,16.51 63.48,16.62 2START2.1 | ARDUINO_MEGA.46 72.33,17.7 67.14,17.7 66.28,16.84 2START.1
  Top 0.813: 2START1.1 2START3.1 61.1,16.51 63.48,16.51 2START2.1 2START.1
OUT2_UP
  Top 0.229: 2UP3.1 61.1,26.77 61.1,26.67 | 63.48,26.67 63.48,26.77 2UP2.1 | ARDUINO_MEGA.45 74.92,20.51 74.05,20.51 72.97,21.59 71.03,21.59 66.28,26.34 2UP.1
  Top 0.813: 2UP1.1 2UP3.1 61.1,26.67 63.48,26.67 2UP2.1 2UP.1
OUT2_X  (via drill 0.33)
  Top 0.229: v49.87,34.54 54.41,30.01 54.41,2.59 ARDUINO_MEGA.A9 | 2X3.1 61.1,41.88 61.1,41.91 | 2X2.1 63.48,41.88 63.48,41.91
  Top 0.813: 2X1.1 2X3.1 61.1,41.91 63.48,41.91 2X2.1 2X.1
  Bottom 0.229: v49.87,34.54 46.42,38 40.16,38 39.29,38.86 39.29,42.53 39.94,43.18 57.21,43.18 58.29,42.1 2X1.1
OUT2_Y  (via drill 0.33)
  Top 0.229: 2V3.1 61.1,47.07 61.1,46.99 | 63.48,46.99 63.48,47.07 2V2.1 | v76.64,44.48 76.64,50.95 75.35,52.25 71.89,52.25 70.81,51.17 70.81,49.87 68.22,47.28 66.28,47.28 2V.1
  Top 0.813: 2V1.1 2V3.1 61.1,46.99 63.48,46.99 2V2.1 2V.1
  Bottom 0.229: v76.64,44.48 76.64,12.52 75.56,11.44 71.68,11.44 71.03,12.09 71.03,13.17 72.33,14.46 72.33,15.11 ARDUINO_MEGA.48
ROTARY_1  (via drill 0.33)
  Top 0.229: v31.95,29.15 31.95,39.29 ROTARY.1 | v67.36,7.34 71.46,11.44 73.84,11.44 74.92,10.36 ARDUINO_MEGA.53
  Bottom 0.229: v31.95,29.15 31.95,25.91 34.76,23.1 34.98,23.1 38,20.08 38,7.12 40.16,4.97 66.5,4.97 67.36,5.83 v67.36,7.34
ROTARY_2
  Bottom 0.229: ROTARY.2 29.36,39.29 29.36,35.84 39.29,25.91 39.29,13.39 40.16,12.52 48.79,12.52 57,20.73 57,22.02 57.86,22.89 66.71,22.89 68.66,20.94 68.66,13.82 72.33,10.15 ARDUINO_MEGA.52
ROTARY_3  (via drill 0.33)
  Top 0.229: v55.92,12.09 55.92,6.91 57.86,4.97 73.62,4.97 74.92,6.26 75.56,6.26 76.21,6.91 76.21,10.79 75.13,11.87 75.13,12.52 ARDUINO_MEGA.51
  Bottom 0.229: v55.92,12.09 39.94,12.09 38.86,13.17 38.86,25.69 26.77,37.78 26.77,39.29 ROTARY.3
ROTARY_4  (via drill 0.33)
  Top 0.229: v67.36,11.23 70.6,11.23 71.89,12.52 72.33,12.52 ARDUINO_MEGA.50
  Bottom 0.229: v67.36,11.23 40.16,11.23 38.43,12.95 38.43,20.3 35.19,23.53 34.98,23.53 33.25,25.26 33.25,28.93 24.18,38 24.18,39.29 ROTARY.4
ROTARY_5
  Bottom 0.229: ROTARY.5 21.59,42.75 15.11,49.23 15.11,50.74 ARDUINO_MEGA.10
ROTARY_6
  Bottom 0.229: ROTARY.6 19,39.51 19,44.26 12.52,50.74 ARDUINO_MEGA.11
ROTARY_7
  Bottom 0.229: SPDT.1 26.56,45.77 26.56,46.2 20.51,52.25 11.23,52.25 9.93,50.95 ARDUINO_MEGA.12
ROTARY_8  (via drill 0.33)
  Top 0.229: v15.11,47.07 15.76,47.71 27.2,47.71 29.15,45.77 SPDT.2
  Bottom 0.229: v15.11,47.07 13.17,47.07 10.79,49.44 8.85,49.44 7.56,50.74 ARDUINO_MEGA.13
VIN
  Top 0.229: 2VIN3.1 61.1,6.48 61.1,6.35 | 63.48,6.35 63.48,6.48 2VIN2.1 | ARDUINO_MEGA.VIN 24.18,2.38 27.42,2.38 28.71,1.08 47.5,1.08 48.36,1.94 48.36,6.04 VIN.1 | 43.18,6.48 1VIN2.1 | 1VIN1.1 45.77,6.48 45.77,6.35
  Top 0.813: 1VIN3.1 1VIN2.1 1VIN1.1 45.77,6.35 VIN.1 | 2VIN1.1 2VIN3.1 61.1,6.35 63.48,6.35 2VIN2.1 2VIN.1
  Bottom 0.229: 2VIN1.1 58.29,6.48 48.36,6.48 VIN.1

### Text on the board
tNames: GND | 10k | Data | 1 | 2 | GND | Latch | 6 | 5 | 4 | 3 | 2 | 1 | 10k | Clock | GND | 5v | Player 1 | Player 2 | Player 1 | Player 2 | SNES Co-Op v2 | GND | 5v | 600 | 600 | 600 | Player 2 | 600 | 600 | 600 | 600 | 600 | Player 1 | 100